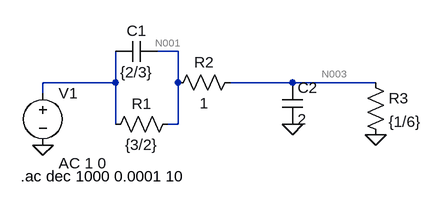
[diagram p0: schematic ej2a.asc]
ej2a.asc, the LTspice schematic file:
Version 4
SHEET 1 880 680
WIRE 96 112 64 112
WIRE 0 160 0 112
WIRE 0 160 -112 160
WIRE 96 160 96 112
WIRE 272 160 176 160
WIRE 400 160 272 160
WIRE -112 176 -112 160
WIRE 0 224 0 160
WIRE 96 224 96 160
WIRE 96 224 80 224
FLAG 272 224 0
FLAG 400 240 0
FLAG -112 256 0
SYMBOL cap 64 96 R90
WINDOW 0 0 32 VBottom 2
WINDOW 3 32 32 VTop 2
SYMATTR InstName C1
SYMATTR Value {2/3}
SYMBOL res 96 208 R90
WINDOW 0 0 56 VBottom 2
WINDOW 3 32 56 VTop 2
SYMATTR InstName R1
SYMATTR Value {3/2}
SYMBOL res 192 144 R90
WINDOW 0 0 56 VBottom 2
WINDOW 3 32 56 VTop 2
SYMATTR InstName R2
SYMATTR Value 1
SYMBOL cap 256 160 R0
SYMATTR InstName C2
SYMATTR Value 2
SYMBOL res 384 144 R0
SYMATTR InstName R3
SYMATTR Value {1/6}
SYMBOL voltage -112 160 R0
WINDOW 123 24 124 Left 2
WINDOW 39 0 0 Left 0
SYMATTR InstName V1
SYMATTR Value ""
SYMATTR Value2 AC 1 0
TEXT -146 304 Left 2 !.ac dec 1000 0.0001 10

The netlist it stands for:
* ej2a.asc
C1 N001 N002 {2/3}
R1 N001 N002 {3/2}
R2 N003 N001 1
C2 N003 0 2
R3 N003 0 {1/6}
V1 N002 0 AC 1 0
.ac dec 1000 0.0001 10
.backanno
.end

* Results of the author's LTspice run, read from the files saved beside the schematic
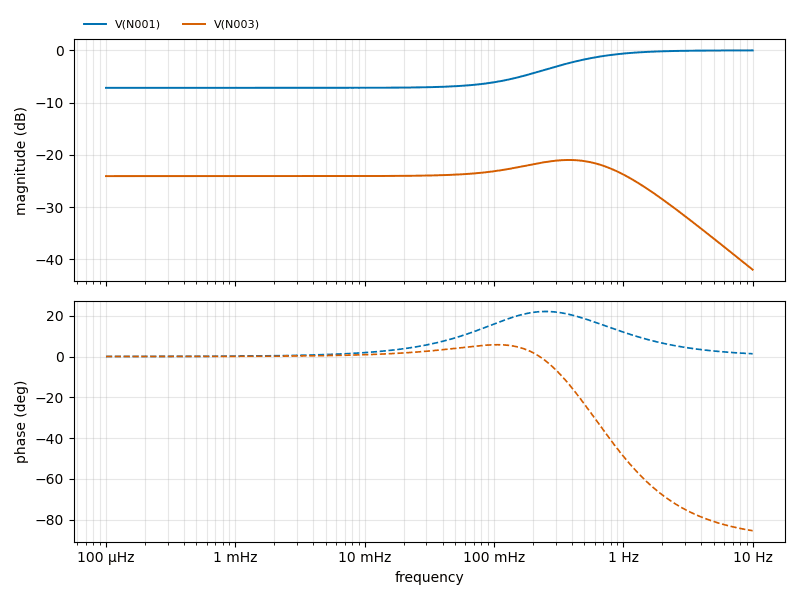
[diagram p1: AC Analysis of ej2a.asc, plotted from the saved traces]
* AC Analysis, 1 run:
*   V(N001): -7.18 dB at 100 µHz, -0.01 dB at 10 Hz, peak -0.01 dB at 10 Hz, 3 dB below the peak at 310.5 mHz
*   V(N003): -24.08 dB at 100 µHz, -42.01 dB at 10 Hz, peak -20.99 dB at 380.2 mHz, 3 dB below the peak at 26.28 mHz and 1.041 Hz